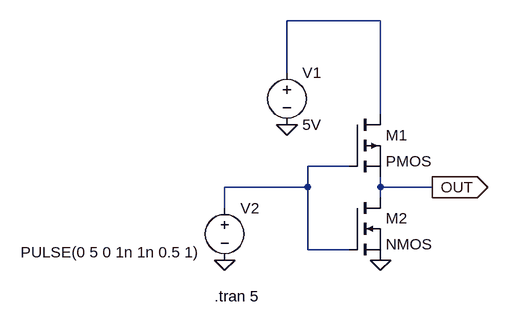
[diagram p0: schematic CMOS INVERTER.asc]
CMOS INVERTER.asc, the LTspice schematic file:
Version 4
SHEET 1 880 680
WIRE 208 -80 64 -80
WIRE 64 0 64 -80
WIRE 208 64 208 -80
WIRE 160 144 96 144
WIRE 96 176 96 144
WIRE 96 176 -32 176
WIRE 208 176 208 160
WIRE 288 176 208 176
WIRE 208 192 208 176
WIRE -32 208 -32 176
WIRE 96 272 96 176
WIRE 160 272 96 272
FLAG 208 288 0
FLAG 64 80 0
FLAG -32 288 0
FLAG 288 176 OUT
IOPIN 288 176 Out
SYMBOL pmos 160 64 R0
SYMATTR InstName M1
SYMBOL nmos 160 192 R0
SYMATTR InstName M2
SYMBOL voltage 64 -16 R0
WINDOW 123 0 0 Left 0
WINDOW 39 0 0 Left 0
SYMATTR InstName V1
SYMATTR Value 5V
SYMBOL voltage -32 192 R0
WINDOW 123 0 0 Left 0
WINDOW 39 0 0 Left 0
WINDOW 3 -314 84 Left 2
SYMATTR InstName V2
SYMATTR Value PULSE(0 5 0 1n 1n 0.5 1)
TEXT -48 344 Left 2 !.tran 5

The netlist it stands for:
* CMOS INVERTER.asc
M1 N001 N002 OUT OUT PMOS
M2 OUT N002 0 0 NMOS
V1 N001 0 5V
V2 N002 0 PULSE(0 5 0 1n 1n 0.5 1)
.model NMOS NMOS
.model PMOS PMOS
.lib standard.mos
.tran 5
.backanno
.end